# EAGLE design XICIE_AFE_SMD_revA (EAGLE 6.4)
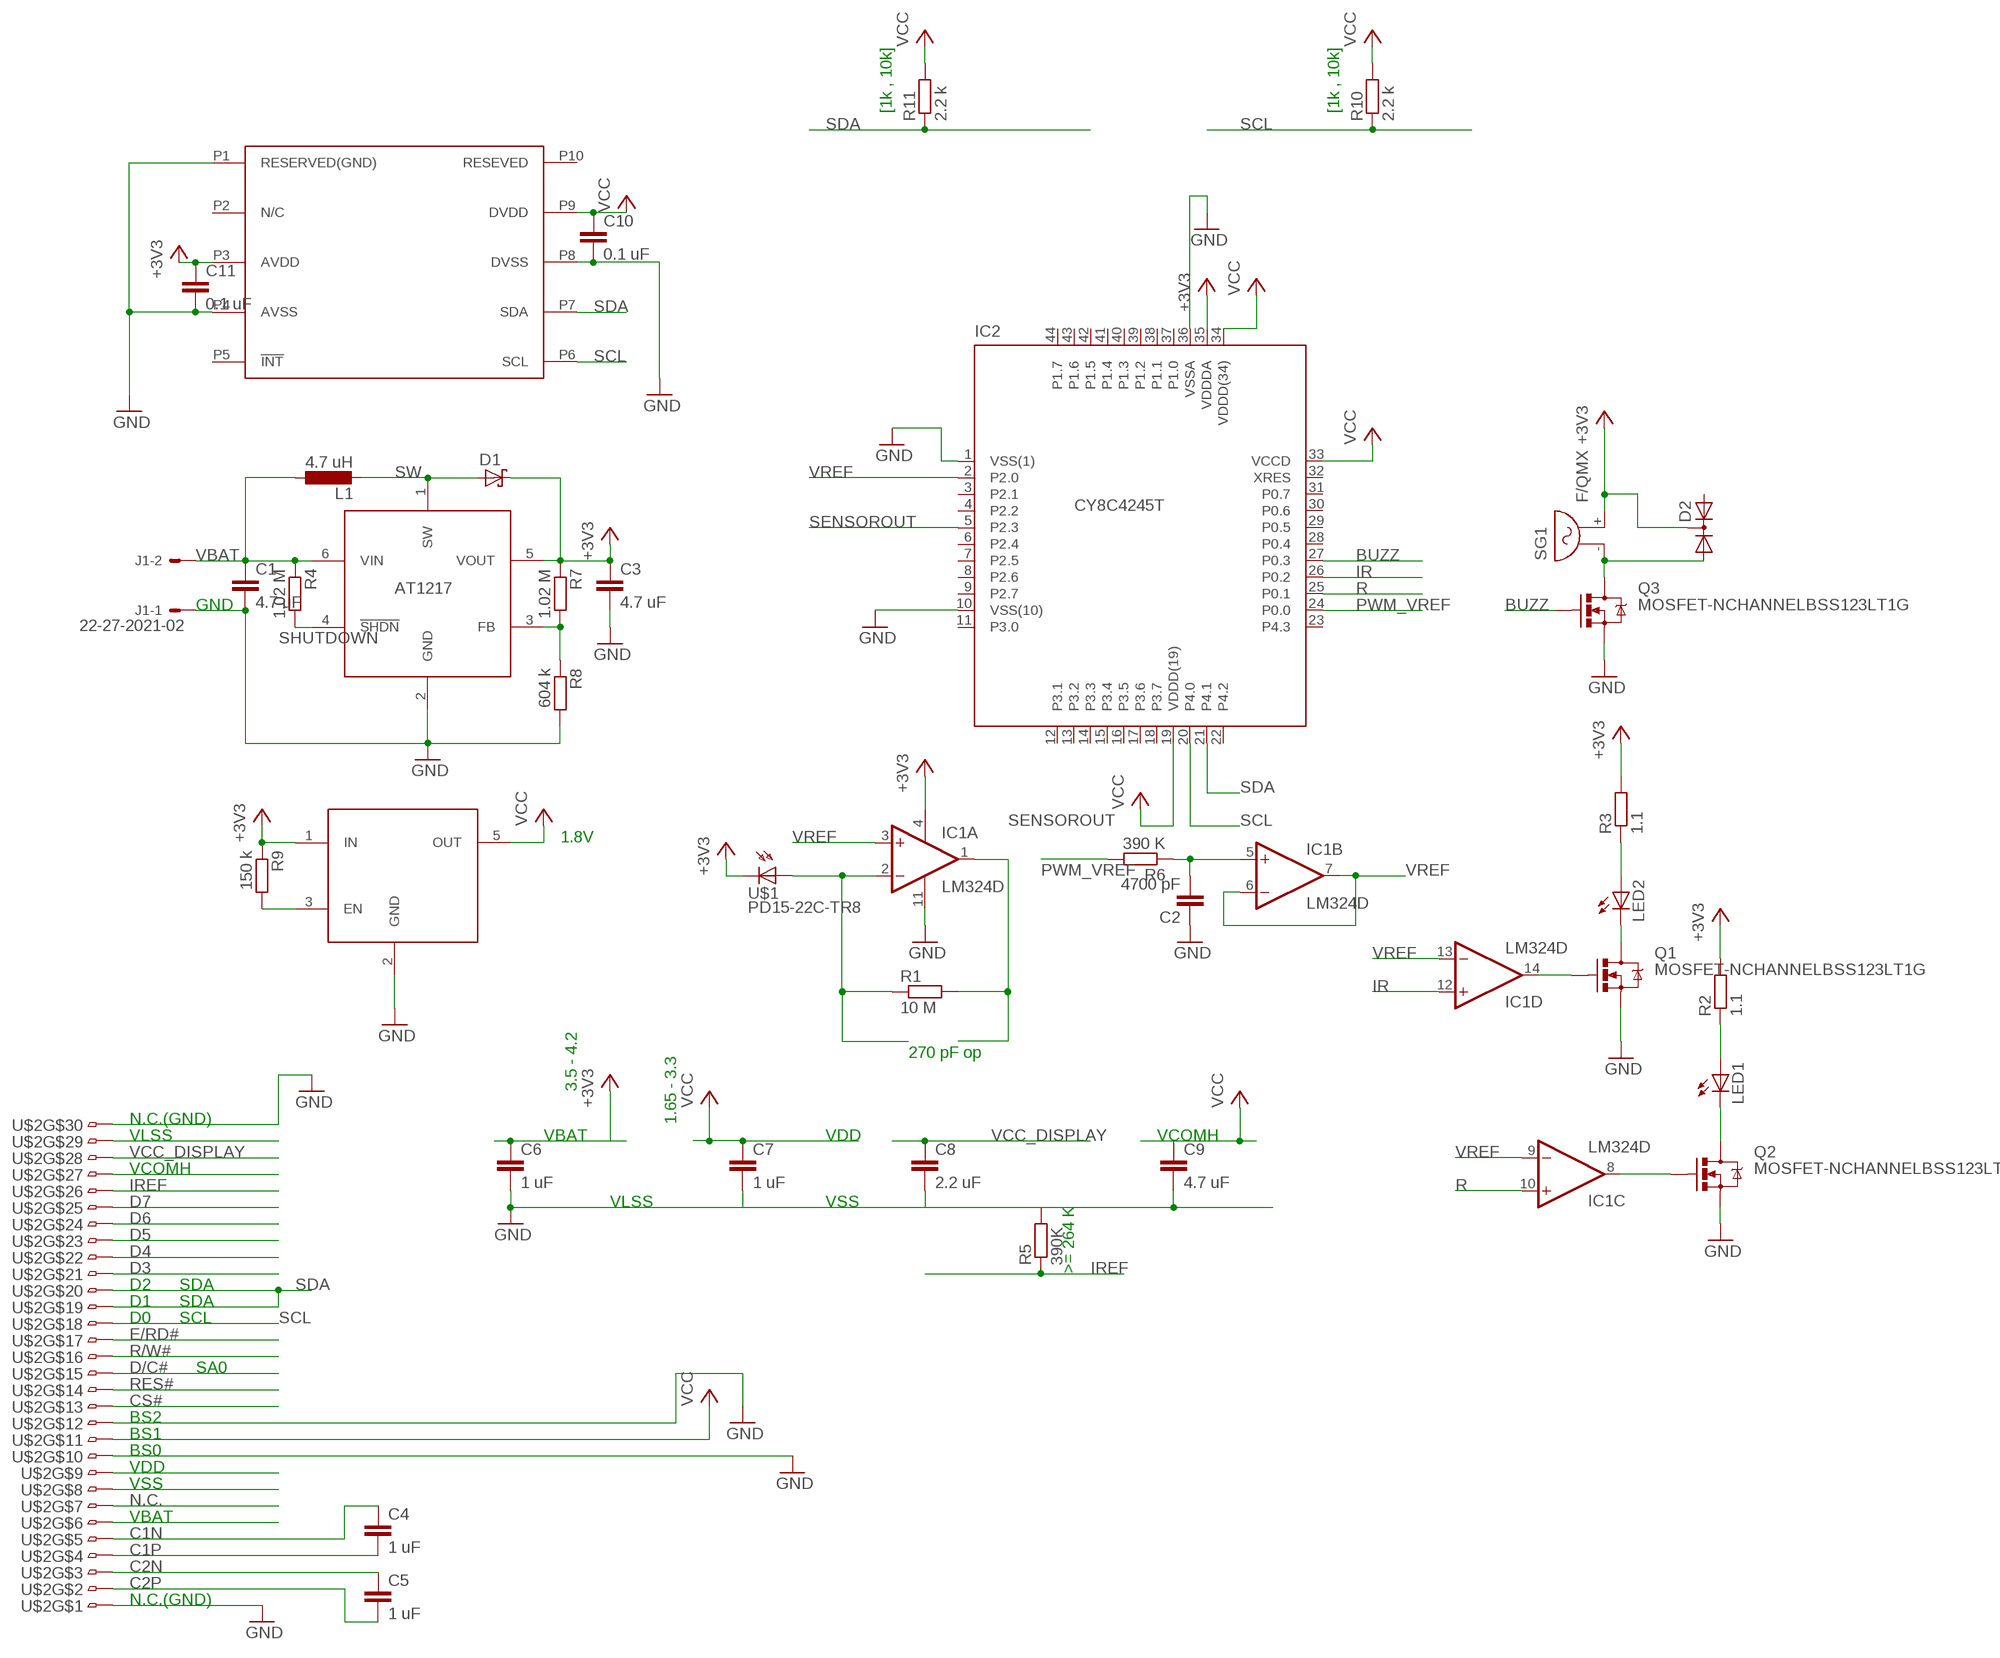
[diagram p0: schematic, sheet 1]

## Parts
C1  4.7 uF  C-EUC0603  [C0603]
C2  4700 pF  C-EUC0402  [C0402]
C3  4.7 uF  C-EUC0603  [C0603]
C4  1 uF  C-EUC0402  [C0402]
C5  1 uF  C-EUC0402  [C0402]
C6  1 uF  C-EUC0402  [C0402]
C7  1 uF  C-EUC0402  [C0402]
C8  2.2 uF  C-EUC0603  [C0603]
C9  4.7 uF  C-EUC0603  [C0603]
C10  0.1 uF  C-EUC0402  [C0402]
C11  0.1 uF  C-EUC0402  [C0402]
D1  SCHOTTKY-DIODESMD  [SMINI2-F5-B]
D2  DIODE-2AC|CASOT23  [SOT23]
IC1  LM324D  [SO14]
IC2  CY8C4245T  [TQFP44]
IC3  AAT1217  [SOT23-6]
J1  22-27-2021-02  [6410-02]
L1  4.7 uH  L-EU  [L2518]
LED1  LED5MM  [LED5MM]
LED2  LED5MM  [LED5MM]
Q1  MOSFET-NCHANNELBSS123LT1G  [SOT23]
Q2  MOSFET-NCHANNELBSS123LT1G  [SOT23]
Q3  MOSFET-NCHANNELBSS123LT1G  [SOT23]
R1  10 M  R-EU_R0402  [R0402]
R2  1.1  R-EU_R0402  [R0402]
R3  1.1  R-EU_R0402  [R0402]
R4  1.02 M  R-EU_R0805  [R0805]
R5  390K  R-EU_R0603  [R0603]
R6  390 K  R-EU_R0603  [R0603]
R7  1.02 M  R-EU_R0805  [R0805]
R8  604 k  R-EU_R0603  [R0603]
R9  150 k  R-EU_R0603  [R0603]
R10  2.2 k  R-EU_R0402  [R0402]
R11  2.2 k  R-EU_R0402  [R0402]
SG1  F/QMX  [F/QMX]
U$1  PD15-22C-TR8  [PHOTO_SMD]
U$2  ER-OLED0.96  [FLEX0.7X30]
U$3  AAT3221  [SOT23-5]
U$4  MMA7660FC  [DFN10]

## Nets
+3V3 [V]: C3.1 C6.1 C11.1 D1.C D2.3(C) IC1.4(P:V+) IC2.35(VDDDA) IC3.5(VOUT) R2.2 R3.2 R7.1 R9.1 SG1.+ U$1.CATHODE1(C) U$1.CATHODE2(C) U$2.P6 U$3.1(IN) U$4.P3(AVDD)
BUZZ: IC2.27(P0.3) Q3.1(G)
C1N: C4.1 U$2.P5
C1P: C4.2 U$2.P4
C2N: C5.1 U$2.P3
C2P: C5.2 U$2.P2
CS#: U$2.P13
D3: U$2.P21
D4: U$2.P22
D5: U$2.P23
D6: U$2.P24
D7: U$2.P25
D/C#: U$2.P15
E/RD#: U$2.P17
GND [GND]: C1.2 C2.1 C3.2 C6.2 C7.2 C8.2 C9.2 C10.2 C11.2 IC1.11(P:V-) IC2.1(VSS(1)) IC2.10(VSS(10)) IC2.36(VSSA) IC3.2(GND) J1.1 Q1.2(S) Q2.2(S) Q3.2(S) R5.2 R8.2 U$2.P1 U$2.P8 U$2.P10 U$2.P12 U$2.P29 U$2.P30 U$3.2(GND) U$4.P1(RESERVED(GND)) U$4.P4(AVSS) U$4.P8(DVSS)
IR: IC1.12(D:+IN) IC2.26(P0.2)
IREF: R5.1 U$2.P26
N$1: IC1.2(A:-IN) R1.1 U$1.ANODE1(A) U$1.ANODE2(A)
N$3: IC1.8(C:OUT) Q2.1(G)
N$4: IC1.14(D:OUT) Q1.1(G)
N$5: LED1.K(C) Q2.3(D)
N$6: LED2.K(C) Q1.3(D)
N$7: LED1.A R2.1
N$8: LED2.A R3.1
N$9: C2.2 IC1.5(B:+IN) R6.1
N$12: IC3.3(FB) R7.2 R8.1
N$13: D2.1(A1) Q3.3(D) SG1.-
N$14: R9.2 U$3.3(EN)
N.C.: U$2.P7
PWM_VREF: IC2.24(P0.0) R6.2
R: IC1.10(C:+IN) IC2.25(P0.1)
R/W#: U$2.P16
RES#: U$2.P14
SCL: IC2.20(P4.0) R10.1 U$2.P18 U$4.P6(SCL)
SDA: IC2.21(P4.1) R11.1 U$2.P19 U$2.P20 U$4.P7(SDA)
SENSOROUT: IC1.1(A:OUT) IC2.5(P2.3) R1.2
SHUTDOWN: IC3.4(!SHDN) R4.2
SW: D1.A IC3.1(SW) L1.2
VBAT [V]: C1.1 IC3.6(VIN) J1.2 L1.1 R4.1
VCC [V]: C7.1 C9.1 C10.1 IC2.19(VDDD(19)) IC2.33(VCCD) IC2.34(VDDD(34)) R10.2 R11.2 U$2.P9 U$2.P11 U$2.P27 U$3.5(OUT) U$4.P9(DVDD)
VCC_DISPLAY [V]: C8.1 U$2.P28
VREF: IC1.3(A:+IN) IC1.6(B:-IN) IC1.7(B:OUT) IC1.9(C:-IN) IC1.13(D:-IN) IC2.2(P2.0)
Unconnected: D2.2(A2) IC2.3(P2.1) IC2.6(P2.4) IC2.7(P2.5) IC2.9(P2.7) IC2.11(P3.0) IC2.12(P3.1) IC2.13(P3.2) IC2.14(P3.3) IC2.15(P3.4) IC2.16(P3.5) IC2.18(P3.7) IC2.22(P4.2) IC2.23(P4.3) IC2.28(P0.4) IC2.29(P0.5) IC2.31(P0.7) IC2.32(XRES) IC2.37(P1.0) IC2.38(P1.1) IC2.40(P1.3) IC2.41(P1.4) IC2.42(P1.5) IC2.43(P1.6) IC2.44(P1.7) U$4.P2(N/C) U$4.P5(!INT) U$4.P10(RESEVED)

## Notes on the sheet
- [1k , 10k] | [1k , 10k]
- GND
- 1.8V
- 270 pF op
- 3.5 - 4.2
- N.C.(GND) | 1.65 - 3.3
- VLSS | VBAT | VDD | VCOMH
- VCOMH
- VLSS | VSS
- >= 264 K
- D2 | SDA
- D1 | SDA
- D0 | SCL
- SA0
- BS2
- BS1
- BS0
- VDD
- VSS
- VBAT
- N.C.(GND)

## Power pins joined to a net without a drawn wire
P0.6: IC2.30(P0.6)
P1.2: IC2.39(P1.2)
P2.2: IC2.4(P2.2)
P2.6: IC2.8(P2.6)
P3.6: IC2.17(P3.6)

## Library data of the parts
C1-C11 = rcl:C-EU: CAPACITOR, European symbol
D1 = juliano:SCHOTTKY-DIODE: Schottky Diode
D2 = diode:DIODE-2AC|CA: Dual DIODE Anode-Cathode|Cathode-Anode
IC1 = linear:LM324: OP AMP
IC2 = juliano:CY8C4245: PSoC® Programmable System-on-Chip TM M8C Processor Speeds up to 24 MHz Source: http://www.cypress.com .. CY8C4245AXI-483; OC_FARNELL: unknown; OC_NEWARK: unknown
IC3 = juliano:AAT1217
J1 = con-molex:22-?-02: CONNECTOR wire to board 2.54 mm (.1 inch) pitch header; OC_FARNELL: unknown; OC_NEWARK: unknown
L1 = juliano:L-EU: INDUCTOR, European symbol
LED1 LED2 = led:LED: LED OSRAM: - CHIPLED LG R971, LG N971, LY N971, LG Q971, LY Q971, LO R971, LY R971 LH N974, LH R974 LS Q976, LO Q976, LY Q976 LO Q996 - Hyper CHIPLED LW Q18S LB Q993, LB Q99A, LB R99A - SideLED LS A670, LO A670, LY A670, LG A670, LP A670 LB A673, LV A673, LT A673, LW A673 LH A674 LY A675 LS A676, LA A676, LO A676, LY A676, LW A676 LS A679, LY A679, LG A679 - Hyper Micro SIDELED® LS Y876, LA Y876, LO Y876, LY Y876 LT Y87S - SmartLED LW L88C, LW L88S LB L89C, LB L89S, LG L890 LS L89K, LO L89K, LY L89K LS L896, LA L896, LO L896, LY L896 - TOPLED LS T670, LO T670, LY T670, LG T670, LP T670 LSG T670, LSP T670, LSY T670, LOP T670, LYG T670 LG T671, LOG T671, LSG T671 LB T673, LV T673, LT T673, LW T673 LH T674 LS T676, LA T676, LO T676, LY T676, LB T676, LH T676, LSB T676, LW T676 LB T67C, LV T67C, LT T67C, LS T67K, LO T67K, LY T67K, LW E67C LS E67B, LA E67B, LO E67B, LY E67B, LB E67C, LV E67C, LT E67C LW T67C LS T679, LY T679, LG T679 LS T770, LO T770, LY T770, LG T770, LP T770 LB T773, LV T773, LT T773, LW T773 LH T774 LS E675, LA E675, LY E675, LS T675 LS T776, LA T776, LO T776, LY T776, LB T776 LHGB T686 LT T68C, LB T68C - Hyper Mini TOPLED® LB M676 - Mini TOPLED Santana® LG M470 LS M47K, LO M47K, LY M47K Source: http://www.osram.convergy.de LUXEON: - LUMILED® LXK2-PW12-R00, LXK2-PW12-S00, LXK2-PW14-U00, LXK2-PW14-V00 LXK2-PM12-R00, LXK2-PM12-S00, LXK2-PM14-U00 LXK2-PE12-Q00, LXK2-PE12-R00, LXK2-PE12-S00, LXK2-PE14-T00, LXK2-PE14-U00 LXK2-PB12-K00, LXK2-PB12-L00, LXK2-PB12-M00, LXK2-PB14-N00, LXK2-PB14-P00, LXK2-PB14-Q00 LXK2-PR12-L00, LXK2-PR12-M00, LXK2-PR14-Q00, LXK2-PR14-R00 LXK2-PD12-Q00, LXK2-PD12-R00, LXK2-PD12-S00 LXK2-PH12-R00, LXK2-PH12-S00 LXK2-PL12-P00, LXK2-PL12-Q00, LXK2-PL12-R00 Source: www.luxeon.com KINGBRIGHT: KA-3528ASYC Source: www.kingbright.com
Q1-Q3 = SparkFun-DiscreteSemi:MOSFET-NCHANNEL: Common NMOSFET Parts MFG P/N Store ID Prod ID FDD8780 TRANS-09984 SI7820DN TRANS-11055 FDS6630A IC-08089 2N7002PW TRANS-11151 FQP30N06L COM-10213 TRANS-10060 BSS123LT1G TRANS-08345 BSS138 TRANS-00830 BS170 2N7000; PROD_ID: TRANS-08345
R1-R4 R6-R11 = rcl:R-EU_: RESISTOR, European symbol
R5 = resistor:R-EU_: RESISTOR, European symbol
SG1 = buzzer:F/QMX: BUZZER Source: Buerklin; OC_FARNELL: unknown; OC_NEWARK: unknown
U$1 = juliano:PD15-22C-TR8
U$2 = juliano:ER-OLED0.96
U$3 = juliano:AAT3221
U$4 = juliano:MMA7660FC

## Board
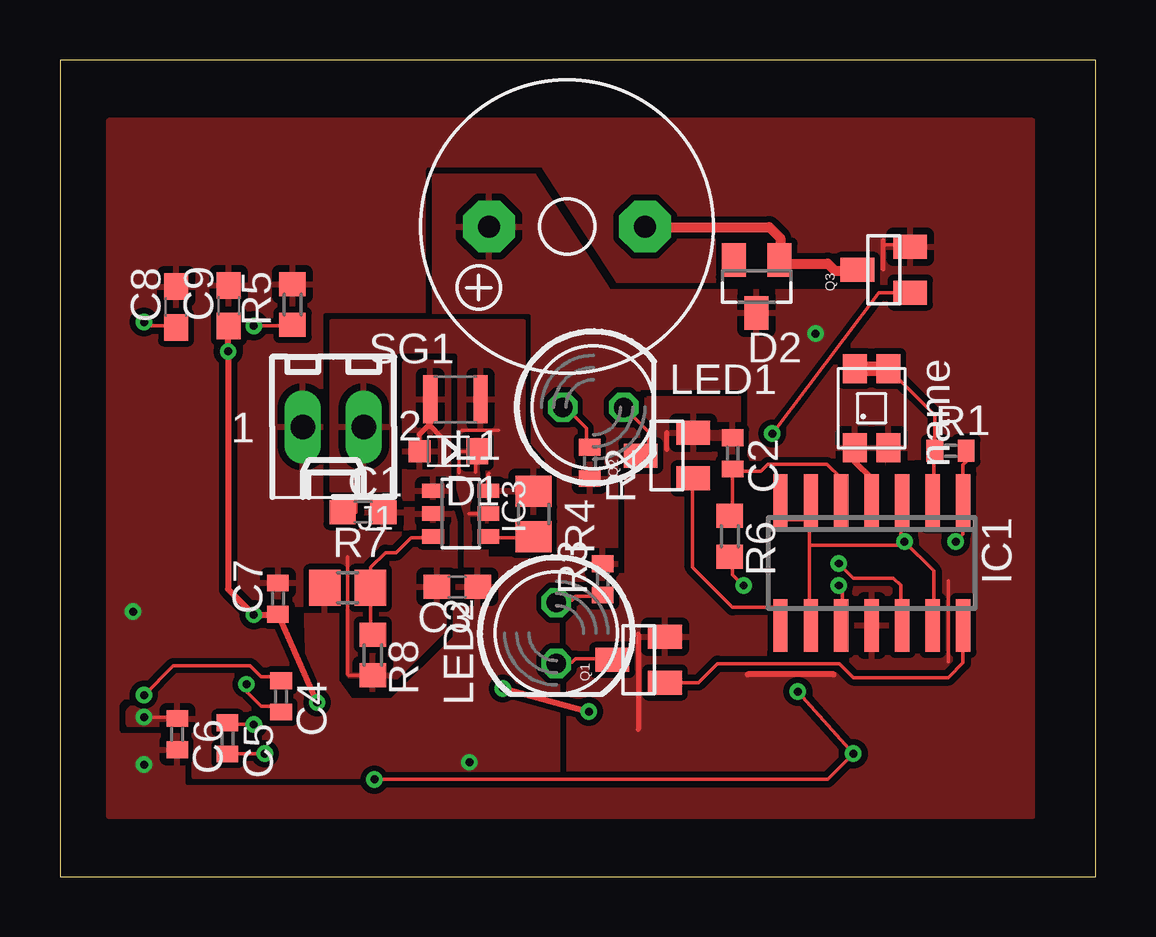
[diagram p1: board, top side]
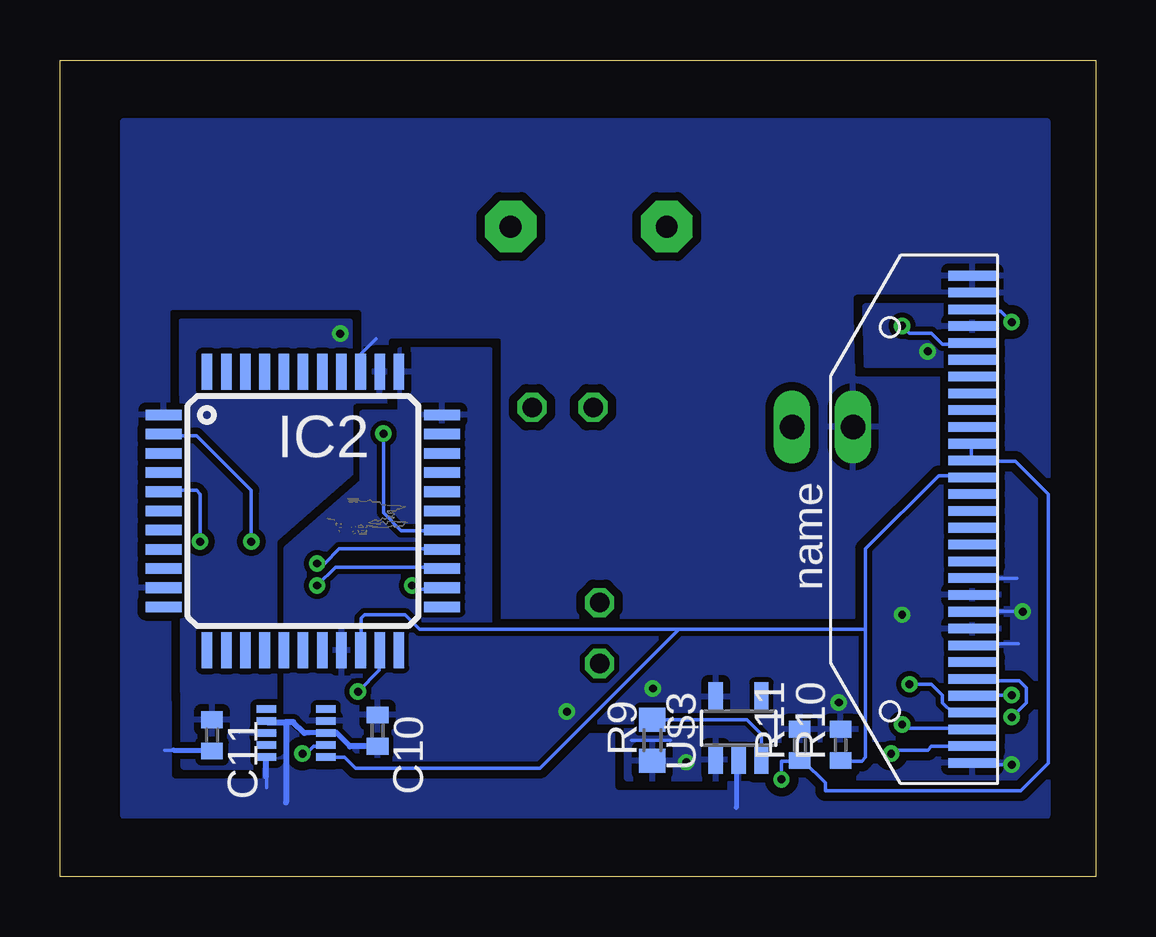
[diagram p2: board, bottom side, seen from below]

Size 43.18 x 34.04 mm. Coordinates in mm from the lower left corner, seen from the top.
Outline: 0,0 43.18,0 43.18,34.04 0,34.04 0,0
Copper layers (1*16): Top 0.0356mm / dielectric 1.5011mm / Bottom 0.0356mm
Design rules "LaenPCBOrder *": minimum track width 6mil, minimum drill 13mil, track to track 6mil, track to pad 8mil, pad to pad 6mil, via to via 6mil, smd to smd 6mil, copper to edge 15mil, drill to drill 6mil, minimum pad ring 7mil, minimum via ring 7mil, stop-mask expansion 3mil, vias tented up to drill 0mil, thermal gap 12mil

### Footprints (pad centres in the part's own frame; a part is rotated, then mirrored left to right if it is on the bottom)
C0603 = smd 1.1 x 1: 1 -0.85,0; 2 0.85,0
C0402 = smd 0.7 x 0.9: 1 -0.65,0; 2 0.65,0
SMINI2-F5-B = smd 0.9 x 0.9: A 1.2,0 | smd 0.9 x 1.1: C -1.2,0
SOT23 = smd 1 x 1.4: 1 -0.95,-1.1; 2 0.95,-1.1; 3 0,1.1
SO14 = smd 0.6 x 2.2: 1 -3.81,-2.6; 2 -2.54,-2.6; 3 -1.27,-2.6; 4 0,-2.6; 5 1.27,-2.6; 6 2.54,-2.6; 7 3.81,-2.6; 8 3.81,2.6; 9 2.54,2.6; 10 1.27,2.6; 11 0,2.6; 12 -1.27,2.6; 13 -2.54,2.6; 14 -3.81,2.6
TQFP44 = smd 1.5 x 0.44: 1 -5.8,4; 2 -5.8,3.2; 3 -5.8,2.4; 4 -5.8,1.6; 5 -5.8,0.8; 6 -5.8,0; 7 -5.8,-0.8; 8 -5.8,-1.6; 9 -5.8,-2.4; 10 -5.8,-3.2; 11 -5.8,-4; 23 5.8,-4; 24 5.8,-3.2; 25 5.8,-2.4; 26 5.8,-1.6; 27 5.8,-0.8; 28 5.8,0; 29 5.8,0.8; 30 5.8,1.6; 31 5.8,2.4; 32 5.8,3.2; 33 5.8,4 | smd 0.44 x 1.5: 12 -4,-5.8; 13 -3.2,-5.8; 14 -2.4,-5.8; 15 -1.6,-5.8; 16 -0.8,-5.8; 17 0,-5.8; 18 0.8,-5.8; 19 1.6,-5.8; 20 2.4,-5.8; 21 3.2,-5.8; 22 4,-5.8; 34 4,5.8; 35 3.2,5.8; 36 2.4,5.8; 37 1.6,5.8; 38 0.8,5.8; 39 0,5.8; 40 -0.8,5.8; 41 -1.6,5.8; 42 -2.4,5.8; 43 -3.2,5.8; 44 -4,5.8
SOT23-6 = smd 0.6 x 0.9: 1 -0.95,-1.15; 2 0,-1.15; 3 0.95,-1.15; 4 0.95,1.15; 5 0,1.15; 6 -0.95,1.15
6410-02 = drill 1.016 long: 1 1.27,0; 2 -1.27,0
L2518 = smd 0.6 x 2: 1 -1.05,0; 2 1.05,0
LED5MM = drill 0.813 octagon: A -1.27,0; K 1.27,0
R0402 = smd 0.7 x 0.9: 1 -0.65,0; 2 0.65,0
R0805 = smd 1.3 x 1.5: 1 -0.95,0; 2 0.95,0
R0603 = smd 1 x 1.1: 1 -0.85,0; 2 0.85,0
F/QMX = drill 0.914 pad 2.159 octagon: + 3.251,0; - -3.251,0
PHOTO_SMD = smd 1.2 x 1: ANODE1 -1.65,0.7; ANODE2 -1.65,-0.7; CATHODE1 1.65,0.7; CATHODE2 1.65,-0.7
FLEX0.7X30 = smd 0.4 x 2: P1 -10.15,0; P2 -9.45,0; P3 -8.75,0; P4 -8.05,0; P5 -7.35,0; P6 -6.65,0; P7 -5.95,0; P8 -5.25,0; P9 -4.55,0; P10 -3.85,0; P11 -3.15,0; P12 -2.45,0; P13 -1.75,0; P14 -1.05,0; P15 -0.35,0; P16 0.35,0; P17 1.05,0; P18 1.75,0; P19 2.45,0; P20 3.15,0; P21 3.85,0; P22 4.55,0; P23 5.25,0; P24 5.95,0; P25 6.65,0; P26 7.35,0; P27 8.05,0; P28 8.75,0; P29 9.45,0; P30 10.15,0
SOT23-5 = smd 0.6 x 1.2: 1 -0.95,-1.306; 2 0,-1.306; 3 0.95,-1.306; 4 0.95,1.306; 5 -0.95,1.306
DFN10 = smd 0.3 x 0.825: P1 -1,1.24; P2 -0.5,1.24; P3 0,1.24; P4 0.5,1.24; P5 1,1.24; P6 -1,-1.24; P7 -0.5,-1.24; P8 0,-1.24; P9 0.5,-1.24; P10 1,-1.24

### Placement (x,y rotation side)
C1  12.63,15.2 0 top
C2  28.04,17.65 270 top
C3  16.56,12.09 180 top
C4  9.22,7.52 270 top
C5  6.99,5.77 270 top
C6  4.89,5.95 270 top
C7  9.09,11.6 90 top
C8  4.84,23.75 90 top
C9  7.04,23.8 90 top
C10  29.94,6.1 270 bottom
C11  36.84,5.9 270 bottom
D1  16.19,17.74 180 top
D2  29.04,24.6 180 top
IC1  33.84,13.08 180 top
IC2  33.05,15.25 0 bottom
IC3  16.7,15.14 270 top
J1  11.39,18.75 180 top
L1  16.48,19.9 180 top
LED1  22.23,19.57 0 top
LED2  20.69,10.16 270 top
Q1  24.12,9.05 90 top
Q2  25.3,17.56 90 top
Q3  34.34,25.3 90 top
R1  37.12,17.76 0 top
R2  22.09,17.25 270 top
R3  22.62,12.4 90 top
R4  19.74,15.12 270 top
R5  9.69,23.85 90 top
R6  27.92,14.2 270 top
R7  11.99,12.05 0 top
R8  13.04,9.25 270 top
R9  18.49,5.7 90 bottom
R10  10.64,5.5 90 bottom
R11  12.34,5.5 90 bottom
SG1  21.14,27.1 180 top
U$1  33.83,19.53 270 top
U$2  5.14,14.9 90 bottom
U$3  14.89,6.2 0 bottom
U$4  33.34,6 90 bottom

### Tracks (layer width: path | path; a pad name or v marks a point on that pad's centre or on a via)
+3V3  (via drill 0.33)
  Top 0.152: v3.5,6.66 4.88,6.66 C6.1 | U$1.CATHODE1 34.59,17.93 34.59,18 | 33.38,17.78 U$1.CATHODE2 | IC3.5 17.04,15.14 | D1.C 17.32,17.74 17.32,17.73 | 17.32,17.73 17.32,16.87 | 16.64,16.84 16.64,17.7 17.32,17.73
  Top 0.254: U$1.CATHODE2 33.12,17.3 33.84,16.58 IC1.4
  Bottom 0.152: v3.5,6.66 2.9,7.26 2.9,7.87 3.2,8.18 5.03,8.18 U$2.P6 | 18.61,4.72 18.59,4.83 R9.1 18.74,4.83 | 34.59,6.05 U$4.P3 34.59,6.05 | 34.59,6.05 35.69,6.05 35.71,6.02 | 17.73,5.69 19.36,5.69
  other vias: 31.5,22.63 17.07,4.78
  pour Top (isolate 0.229, rank 5): 20.69,12.4 20.71,4.19 5.61,4.19 5.61,6.35 2.87,6.35 2.87,6.91 4.78,8.84 10.36,8.84 10.29,11.3 11.51,11.46 11.51,8.15 12.09,7.34 13.87,7.34 16.51,9.96 16.54,12.8 16.97,12.8 16.97,15.06 16.51,16.69 16.51,18.54 17.72,18.52 17.74,13.23 20.84,13.23 20.84,16.95 19.54,16.95 19.54,23 15.64,23.2 15.64,29.2 19.74,29.2 22.86,24.38 34.06,24.38 32.77,22.15 36.7,18.49 36.68,17.5 34.57,17.42 34.34,17.45 34.29,17.18 33.38,17.16 33.36,17.35 29.94,17.45 28.79,17.45 28.79,20.4 24.08,20.4 24.08,17.22 23.14,17.3 23.14,12.4
  pour Bottom (rank 5): 10.31,4.09 19.54,4.09 19.54,8.64 10.9,7.85
  pour Bottom (isolate 0.254, rank 5): 38.04,4.6 29.57,4.6 29.65,21.34 31.09,21.34 31.09,23.14 38.12,23.14
BUZZ  (via drill 0.33)
  Top 0.152: v29.69,18.47 34.14,24.33 35.36,24.33 Q3.1
  Bottom 0.152: IC2.27 27.28,14.43 28.96,14.43 29.69,15.16 v29.69,18.47
C1N  (via drill 0.33)
  Top 0.152: v3.5,7.57 4.72,8.79 7.93,8.79 8.38,8.33 8.84,8.33 C4.1
  Bottom 0.152: v3.5,7.57 5.03,7.57 U$2.P5
C1P  (via drill 0.33)
  Top 0.152: v7.77,8.03 7.77,7.72 8.38,7.11 8.84,7.11 C4.2
  Bottom 0.152: v7.77,8.03 6.86,8.03 6.4,7.57 6.4,7.26 5.94,6.81 5.18,6.81 U$2.P4
C2N  (via drill 0.33)
  Top 0.152: v8.08,6.35 7.01,6.35 C5.1
  Bottom 0.152: v8.08,6.35 7.93,6.2 5.18,6.2 U$2.P3
C2P  (via drill 0.33)
  Top 0.152: v8.53,5.13 7.01,5.13 C5.2
  Bottom 0.152: U$2.P2 5.18,5.44 6.86,5.44 7.01,5.28 8.38,5.28 v8.53,5.13 8.69,4.98
GND  (via drill 0.33)
  Top 0.152: 11.99,13.34 11.99,8.43 12.03,8.4 R8.2 | 37.03,12.34 37.03,8.97 | Q3.2 35.35,26.34 34.31,26.34
  Top 0.203: 25.3,17.8 25.3,18.52 | 24.11,10.11 24.11,6.15 | 34.31,25.32 34.31,26.34 34.31,26.52
  Top 0.254: 32.26,8.43 28.68,8.43
  Bottom 0.152: U$4.P1 34.59,4.98 34.57,4.95 34.57,3.71 | 31.7,6.05 32,6.05 U$4.P8 | 30.02,5.44 C10.2 | 34.59,6.5 U$4.P4 34.54,6.45 | 36.88,5.28 C11.2 36.88,5.28 38.81,5.28 | 14.94,3.69 14.94,4.83 U$3.2 | v3.5,4.67 5.03,4.67 U$2.P1 | 3.23,9.7 5.03,9.7 U$2.P8 | 3.13,11.07 5.03,11.07 U$2.P10 | 3.3,12.45 U$2.P12 | IC2.36 30.65,21.78 30,22.43
  Bottom 0.203: 38.45,5.28 36.88,5.28 | U$4.P8 33,6 | 31.09,5.44 31.7,6.05 | U$3.2 14.99,4.79 14.99,2.9
  Bottom 0.254: 34.59,4.19 34.59,4.98 | 30.02,5.44 31.09,5.44 | 33,6 33.45,6.45 33.76,6.45 | 34.54,6.45 33.76,6.45 | 33.76,6.45 33.76,3.1
  other vias: 3.05,11.05
  pour Top (isolate 0.254, rank 6): 2.03,2.54 40.54,2.54 40.54,31.5 2.03,31.5
  pour Bottom (isolate 0.356, rank 6): 2.03,2.54 40.54,2.54 40.54,31.5 2.03,31.5
IR  (via drill 0.33)
  Top 0.152: v32.46,13.06 33.07,12.45 34.75,12.45 35.05,12.14 35.05,10.62 IC1.12
  Bottom 0.152: v32.46,13.06 32.16,13.06 31.55,13.66 27.28,13.66 IC2.26
IREF  (via drill 0.33)
  Top 0.152: v8.08,22.96 9.6,22.96 R5.1
  Bottom 0.152: v8.08,22.96 7.77,22.66 6.86,22.66 6.4,22.2 5.18,22.2 U$2.P26
N$1
  Top 0.152: IC1.2 36.42,15.8 36.42,17.63 R1.1 36.47,19.24 U$1.ANODE1
  Top 0.61: U$1.ANODE2 U$1.ANODE1
N$3
  Top 0.152: Q2.1 26.37,16.56 26.37,12.9 28.04,11.23 30.02,11.23 30.02,10.62 IC1.8
N$4
  Top 0.152: IC1.14 37.64,8.91 37.03,8.31 33.07,8.31 32.49,8.89 27.41,8.89 26.61,8.1 Q1.1
N$5
  Top 0.152: Q2.3 24.23,17.63 24.54,17.63 24.54,18.54 23.62,19.46 LED1.K
N$6
  Top 0.152: Q1.3 23.01,9.09 21.49,9.09 21.34,8.94 20.73,8.94 LED2.K
N$7
  Top 0.152: R2.1 21.95,17.93 21.95,18.69 21.03,19.61 LED1.A
N$8
  Top 0.152: R3.1 22.55,11.68 21.49,11.68 21.34,11.53 21.18,11.68 20.88,11.68 20.73,11.53 LED2.A
N$9
  Top 0.152: R6.1 28.04,15.19 28.04,16.87 C2.2 28.15,16.89 29.21,16.89 29.52,17.2 31.98,17.2 32.57,16.6 IC1.5
N$12
  Top 0.152: IC3.3 15.55,14.12 14.63,14.12 14.02,13.51 13.56,13.51 12.95,12.9 12.95,12.14 R7.2 12.95,11.99 12.95,10.16 R8.1
N$13
  Top 0.152: 30.17,25.55 30.02,25.4 29.87,25.55 D2.1 30.02,25.71 | 33.22,25.25 Q3.3
  Top 0.406: 33.22,25.25 32.31,25.25 32,25.55 30.17,25.55 | 30.02,25.71 30.02,26.62 29.57,27.08 24.54,27.08 SG1.-
N$14
  Bottom 0.152: U$3.3 13.95,5.94 14.55,6.55 R9.2
PWM_VREF  (via drill 0.33)
  Top 0.152: v28.5,12.14 28.04,12.6 28.04,13.21 R6.2
  Bottom 0.152: v28.5,12.14 28.35,11.99 27.28,11.99 IC2.24
R  (via drill 0.33)
  Top 0.152: v32.46,12.14 32.61,11.99 32.61,10.62 IC1.10
  Bottom 0.152: v32.46,12.14 31.7,12.9 27.28,12.9 IC2.25
SCL
  Bottom 0.152: U$4.P6 32,4.98 31.32,4.98 30.86,4.52 23.16,4.52 17.37,10.31 | R10.1 10.52,4.83 9.75,4.83 9.6,4.98 9.6,10.31 | 9.6,10.31 17.37,10.31 | 17.37,10.31 28.19,10.31 28.8,10.92 30.48,10.92 30.63,10.77 30.63,9.55 IC2.20 | U$2.P18 5.18,16.71 6.55,16.71 9.6,13.66 9.6,10.31
SDA  (via drill 0.33)
  Top 0.152: v13.11,4.06 32,4.06 v33.07,5.13 v30.76,7.72
  Bottom 0.152: v33.07,5.13 32.92,5.13 32.61,5.44 32.16,5.44 U$4.P7 | IC2.21 29.87,9.4 29.87,8.61 v30.76,7.72 | U$2.P20 5.18,17.93 5.18,17.48 U$2.P19 5.03,17.32 3.35,17.32 1.98,15.95 1.98,4.72 3.12,3.58 11.28,3.58 11.28,3.91 12.19,4.83 R11.1 12.34,4.83 13.11,4.83 v13.11,4.06
SENSOROUT  (via drill 0.33)
  Top 0.152: 37.64,15.8 37.64,17.17 37.8,17.32 37.8,17.63 R1.2 | 37.64,15.8 IC1.1 37.64,15.65 37.64,14.33 | 37.64,15.8 37.64,14.27 v37.34,13.97
  Bottom 0.152: v37.34,13.97 37.34,15.95 37.49,16.1 38.71,16.1 IC2.5
SHUTDOWN
  Top 0.152: IC3.4 17.98,14.12 19.66,14.12 R4.2
SW
  Top 0.152: L1.2 15.43,18.88 | 14.99,18.44 D1.A | 15.37,18.74 15.47,18.74
  Top 0.203: 15.43,18.88 14.99,18.44 | 15.47,18.74 15.85,18.36
  pour Top (isolate 0.254, rank 2): 14.39,15.75 14.39,21.44 16.18,21.44 16.18,15.8
VBAT
  Top 0.152: 12.34,16.15 12.34,15.19 11.89,15.19 C1.1 | IC3.6 17.85,16.78 17.88,16.81 | 16.76,18.62 18.29,18.62
  pour Top (isolate 0.254, rank 3): 11.34,16.15 14.34,16.15 14.29,21.6 16.54,21.6 16.54,18.15 17.84,18.14 17.86,13.82 20.37,13.95 20.37,16.6 19.3,17.78 19.3,23.11 11.34,23.11
VCC  (via drill 0.33)
  Top 0.152: 8.99,10.92 C7.1 | 7.01,22.81 C9.1
  Top 0.254: 8.99,10.92 v8.08,10.92 7.01,11.99 v7.01,21.9 7.01,22.81 | C7.1 v10.72,7.26 | v18.47,7.85 v22.05,6.88
  Bottom 0.152: U$2.P11 5.18,11.68 5.18,11.75 | U$3.5 15.85,7.57 15.86,7.48
  pour Bottom (isolate 0.203, rank 4): 21.33,6.48 14.69,6.46 13.94,5.69 4.04,5.8 4.04,23.77 9.63,23.77 9.58,21.34 6.3,21.34 6.32,16.6 9.6,13.69 9.62,10.26 25.27,10.26 25.27,21.95 29,21.95 29,19.33 30.58,19.33 30.58,16.43 33.75,13.67 33.75,4.65 23.32,4.65
VCC_DISPLAY  (via drill 0.33)
  Top 0.152: v3.5,23.11 3.66,22.96 4.72,22.96 C8.1
  Bottom 0.152: v3.5,23.11 3.96,23.57 5.03,23.57 U$2.P28
VREF  (via drill 0.33)
  Top 0.152: 31.24,14.88 31.24,15.65 IC1.6 31.24,14.88 | 31.24,14.88 31.24,13.82 | 31.24,13.82 31.24,10.62 IC1.9 | 31.24,14.88 30.02,14.88 30.02,15.65 IC1.7 | v35.2,13.97 35.05,14.12 35.05,15.65 IC1.3 | v35.2,13.97 36.42,12.75 36.42,10.62 IC1.13 | 31.24,13.82 35.05,13.82 v35.2,13.97
  Bottom 0.152: v35.2,13.97 35.2,16.1 37.49,18.39 38.71,18.39 IC2.2